# EAGLE schematic ME461_F28379D (EAGLE 7.7.0)

## Sheet 1 of 5
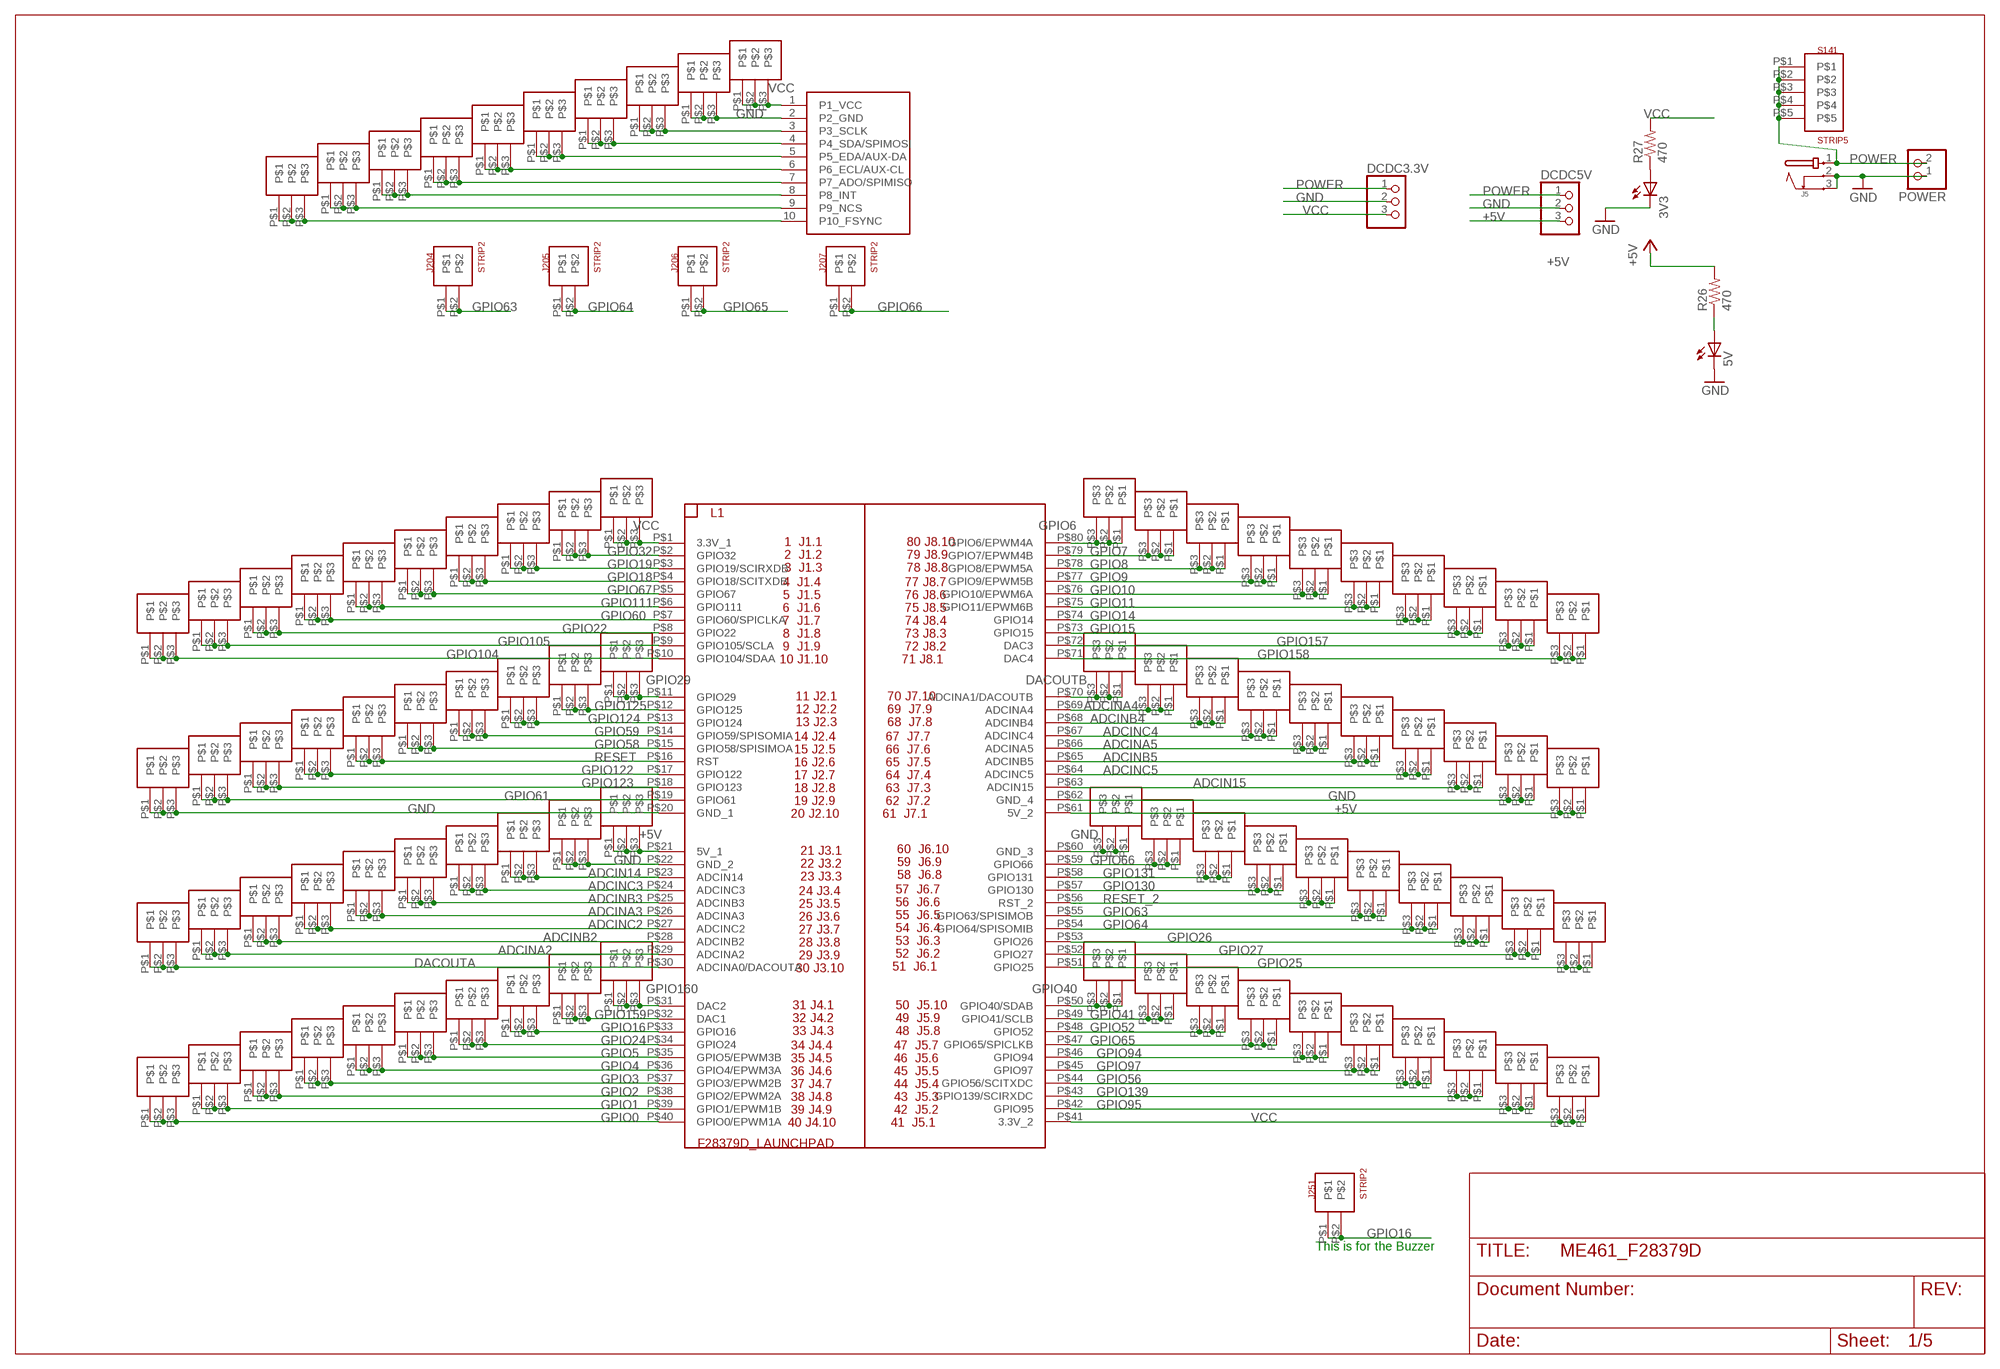
[diagram p0: schematic, sheet 1]

### Parts
3V3  LEDCHIPLED_1206  [CHIPLED_1206]
5V  LEDCHIPLED_1206  [CHIPLED_1206]
DCDC3.3V  PINHD-1X3  [1X03]
DCDC5V  PINHD-1X3  [1X03]
J5  JACK-PMS  [JACK-PMS]
J10  STRIP3  [STRIP3]
J14  STRIP3  [STRIP3]
J15  STRIP3  [STRIP3]
J16  STRIP3  [STRIP3]
J17  STRIP3  [STRIP3]
J18  STRIP3  [STRIP3]
J19  STRIP3  [STRIP3]
J20  STRIP3  [STRIP3]
J21  STRIP3  [STRIP3]
J28  STRIP3  [STRIP3]
J29  STRIP3  [STRIP3]
J30  STRIP3  [STRIP3]
J31  STRIP3  [STRIP3]
J32  STRIP3  [STRIP3]
J33  STRIP3  [STRIP3]
J98  STRIP3  [STRIP3]
J99  STRIP3  [STRIP3]
J100  STRIP3  [STRIP3]
J101  STRIP3  [STRIP3]
J102  STRIP3  [STRIP3]
J103  STRIP3  [STRIP3]
J104  STRIP3  [STRIP3]
J105  STRIP3  [STRIP3]
J106  STRIP3  [STRIP3]
J107  STRIP3  [STRIP3]
J108  STRIP3  [STRIP3]
J109  STRIP3  [STRIP3]
J110  STRIP3  [STRIP3]
J111  STRIP3  [STRIP3]
J112  STRIP3  [STRIP3]
J113  STRIP3  [STRIP3]
J114  STRIP3  [STRIP3]
J115  STRIP3  [STRIP3]
J116  STRIP3  [STRIP3]
J117  STRIP3  [STRIP3]
J118  STRIP3  [STRIP3]
J119  STRIP3  [STRIP3]
J120  STRIP3  [STRIP3]
J121  STRIP3  [STRIP3]
J122  STRIP3  [STRIP3]
J123  STRIP3  [STRIP3]
J124  STRIP3  [STRIP3]
J125  STRIP3  [STRIP3]
J126  STRIP3  [STRIP3]
J127  STRIP3  [STRIP3]
J128  STRIP3  [STRIP3]
J129  STRIP3  [STRIP3]
J130  STRIP3  [STRIP3]
J131  STRIP3  [STRIP3]
J132  STRIP3  [STRIP3]
J133  STRIP3  [STRIP3]
J134  STRIP3  [STRIP3]
J135  STRIP3  [STRIP3]
J136  STRIP3  [STRIP3]
J137  STRIP3  [STRIP3]
J138  STRIP3  [STRIP3]
J139  STRIP3  [STRIP3]
J140  STRIP3  [STRIP3]
J141  STRIP3  [STRIP3]
J142  STRIP3  [STRIP3]
J143  STRIP3  [STRIP3]
J144  STRIP3  [STRIP3]
J145  STRIP3  [STRIP3]
J146  STRIP3  [STRIP3]
J147  STRIP3  [STRIP3]
J148  STRIP3  [STRIP3]
J149  STRIP3  [STRIP3]
J150  STRIP3  [STRIP3]
J151  STRIP3  [STRIP3]
J152  STRIP3  [STRIP3]
J153  STRIP3  [STRIP3]
J154  STRIP3  [STRIP3]
J155  STRIP3  [STRIP3]
J156  STRIP3  [STRIP3]
J157  STRIP3  [STRIP3]
J158  STRIP3  [STRIP3]
J159  STRIP3  [STRIP3]
J160  STRIP3  [STRIP3]
J161  STRIP3  [STRIP3]
J162  STRIP3  [STRIP3]
J163  STRIP3  [STRIP3]
J164  STRIP3  [STRIP3]
J165  STRIP3  [STRIP3]
J166  STRIP3  [STRIP3]
J167  STRIP3  [STRIP3]
J168  STRIP3  [STRIP3]
J169  STRIP3  [STRIP3]
J170  STRIP3  [STRIP3]
J176  STRIP3  [STRIP3]
J177  STRIP3  [STRIP3]
J204  STRIP2  [STRIP2]
J205  STRIP2  [STRIP2]
J206  STRIP2  [STRIP2]
J207  STRIP2  [STRIP2]
J251  STRIP2  [STRIP2]
L1  F28379D_LAUNCHPAD  [F28379D_LAUNCHPAD]
POWER  PINHD-1X2  [1X02]
R26  470  R-US_M1206  [M1206]
R27  470  R-US_M1206  [M1206]
S141  STRIP5  [STRIP5]
U$1  MPU-9250-BB  [MPU-9250-BB]

### Nets
+5V [supply]: DCDC5V.3 J103.P$1 J103.P$2 J103.P$3 J152.P$1 J152.P$2 J152.P$3 L1.P$21(5V_1) L1.P$61(5V_2) R26.2 ; also sheet 2,3,5
ADCIN14: J105.P$1 J105.P$2 J105.P$3 L1.P$23(ADCIN14)
ADCIN15: J150.P$1 J150.P$2 J150.P$3 L1.P$63(ADCIN15)
ADCINA2: J111.P$1 J111.P$2 J111.P$3 L1.P$29(ADCINA2) ; also sheet 5
ADCINA3: J108.P$1 J108.P$2 J108.P$3 L1.P$26(ADCINA3) ; also sheet 5
ADCINA4: J144.P$1 J144.P$2 J144.P$3 L1.P$69(ADCINA4)
ADCINA5: J147.P$1 J147.P$2 J147.P$3 L1.P$66(ADCINA5)
ADCINB2: J110.P$1 J110.P$2 J110.P$3 L1.P$28(ADCINB2)
ADCINB3: J107.P$1 J107.P$2 J107.P$3 L1.P$25(ADCINB3)
ADCINB4: J145.P$1 J145.P$2 J145.P$3 L1.P$68(ADCINB4) ; also sheet 5
ADCINB5: J148.P$1 J148.P$2 J148.P$3 L1.P$65(ADCINB5)
ADCINC2: J109.P$1 J109.P$2 J109.P$3 L1.P$27(ADCINC2)
ADCINC3: J106.P$1 J106.P$2 J106.P$3 L1.P$24(ADCINC3)
ADCINC4: J146.P$1 J146.P$2 J146.P$3 L1.P$67(ADCINC4)
ADCINC5: J149.P$1 J149.P$2 J149.P$3 L1.P$64(ADCINC5)
DACOUTA: J112.P$1 J112.P$2 J112.P$3 L1.P$30(ADCINA0/DACOUTA)
DACOUTB: J143.P$1 J143.P$2 J143.P$3 L1.P$70(ADCINA1/DACOUTB)
GND [supply]: 3V3.C 5V.C DCDC3.3V.2 DCDC5V.2 J5.2 J5.3 J102.P$1 J102.P$2 J102.P$3 J104.P$1 J104.P$2 J104.P$3 J124.P$1 J124.P$2 J124.P$3 J151.P$1 J151.P$2 J151.P$3 J153.P$1 J153.P$2 J153.P$3 L1.P$20(GND_1) L1.P$22(GND_2) L1.P$60(GND_3) L1.P$62(GND_4) POWER.1 U$1.2(P2_GND) ; also sheet 2,3,4,5
GPIO0: J122.P$1 J122.P$2 J122.P$3 L1.P$40(GPIO0/EPWM1A) ; also sheet 5
GPIO1: J121.P$1 J121.P$2 J121.P$3 L1.P$39(GPIO1/EPWM1B) ; also sheet 5
GPIO2: J120.P$1 J120.P$2 J120.P$3 L1.P$38(GPIO2/EPWM2A) ; also sheet 3
GPIO3: J119.P$1 J119.P$2 J119.P$3 L1.P$37(GPIO3/EPWM2B) ; also sheet 3
GPIO4: J118.P$1 J118.P$2 J118.P$3 L1.P$36(GPIO4/EPWM3A) ; also sheet 5
GPIO5: J117.P$1 J117.P$2 J117.P$3 L1.P$35(GPIO5/EPWM3B) ; also sheet 5
GPIO6: J133.P$1 J133.P$2 J133.P$3 L1.P$80(GPIO6/EPWM4A) ; also sheet 5
GPIO7: J134.P$1 J134.P$2 J134.P$3 L1.P$79(GPIO7/EPWM4B) ; also sheet 5
GPIO8: J135.P$1 J135.P$2 J135.P$3 L1.P$78(GPIO8/EPWM5A) ; also sheet 5
GPIO9: J136.P$1 J136.P$2 J136.P$3 L1.P$77(GPIO9/EPWM5B) ; also sheet 2
GPIO10: J137.P$1 J137.P$2 J137.P$3 L1.P$76(GPIO10/EPWM6A) ; also sheet 3
GPIO11: J138.P$1 J138.P$2 J138.P$3 L1.P$75(GPIO11/EPWM6B) ; also sheet 3
GPIO14: J139.P$1 J139.P$2 J139.P$3 L1.P$74(GPIO14) ; also sheet 3
GPIO15: J140.P$1 J140.P$2 J140.P$3 L1.P$73(GPIO15) ; also sheet 3
GPIO16: J115.P$1 J115.P$2 J115.P$3 J251.P$1 J251.P$2 L1.P$33(GPIO16)
GPIO18: J16.P$1 J16.P$2 J16.P$3 L1.P$4(GPIO18/SCITXDB) ; also sheet 5
GPIO19: J15.P$1 J15.P$2 J15.P$3 L1.P$3(GPIO19/SCIRXDB) ; also sheet 5
GPIO22: J20.P$1 J20.P$2 J20.P$3 L1.P$8(GPIO22) ; also sheet 4
GPIO24: J116.P$1 J116.P$2 J116.P$3 L1.P$34(GPIO24) ; also sheet 5
GPIO25: J162.P$1 J162.P$2 J162.P$3 L1.P$51(GPIO25) ; also sheet 4
GPIO26: J160.P$1 J160.P$2 J160.P$3 L1.P$53(GPIO26) ; also sheet 4
GPIO27: J161.P$1 J161.P$2 J161.P$3 L1.P$52(GPIO27) ; also sheet 4
GPIO29: J29.P$1 J29.P$2 J29.P$3 L1.P$11(GPIO29) ; also sheet 3
GPIO32: J14.P$1 J14.P$2 J14.P$3 L1.P$2(GPIO32) ; also sheet 3
GPIO40: J163.P$1 J163.P$2 J163.P$3 L1.P$50(GPIO40/SDAB) ; also sheet 4
GPIO41: J164.P$1 J164.P$2 J164.P$3 L1.P$49(GPIO41/SCLB) ; also sheet 4
GPIO52: J165.P$1 J165.P$2 J165.P$3 L1.P$48(GPIO52)
GPIO56: J169.P$1 J169.P$2 J169.P$3 L1.P$44(GPIO56/SCITXDC) ; also sheet 5
GPIO58: J33.P$1 J33.P$2 J33.P$3 L1.P$15(GPIO58/SPISIMOA) ; also sheet 5
GPIO59: J32.P$1 J32.P$2 J32.P$3 L1.P$14(GPIO59/SPISOMIA) ; also sheet 5
GPIO60: J19.P$1 J19.P$2 J19.P$3 L1.P$7(GPIO60/SPICLKA) ; also sheet 4
GPIO61: J101.P$1 J101.P$2 J101.P$3 L1.P$19(GPIO61) ; also sheet 4
GPIO63: J158.P$1 J158.P$2 J158.P$3 J204.P$1 J204.P$2 L1.P$55(GPIO63/SPISIMOB) ; also sheet 2
GPIO64: J159.P$1 J159.P$2 J159.P$3 J205.P$1 J205.P$2 L1.P$54(GPIO64/SPISOMIB) ; also sheet 2
GPIO65: J166.P$1 J166.P$2 J166.P$3 J206.P$1 J206.P$2 L1.P$47(GPIO65/SPICLKB) ; also sheet 2
GPIO66: J154.P$1 J154.P$2 J154.P$3 J207.P$1 J207.P$2 L1.P$59(GPIO66)
GPIO67: J17.P$1 J17.P$2 J17.P$3 L1.P$5(GPIO67)
GPIO94: J167.P$1 J167.P$2 J167.P$3 L1.P$46(GPIO94) ; also sheet 4
GPIO95: J176.P$1 J176.P$2 J176.P$3 L1.P$42(GPIO95) ; also sheet 4
GPIO97: J168.P$1 J168.P$2 J168.P$3 L1.P$45(GPIO97) ; also sheet 4
GPIO104: J28.P$1 J28.P$2 J28.P$3 L1.P$10(GPIO104/SDAA)
GPIO105: J21.P$1 J21.P$2 J21.P$3 L1.P$9(GPIO105/SCLA)
GPIO111: J18.P$1 J18.P$2 J18.P$3 L1.P$6(GPIO111) ; also sheet 4
GPIO122: J99.P$1 J99.P$2 J99.P$3 L1.P$17(GPIO122) ; also sheet 5
GPIO123: J100.P$1 J100.P$2 J100.P$3 L1.P$18(GPIO123) ; also sheet 5
GPIO124: J31.P$1 J31.P$2 J31.P$3 L1.P$13(GPIO124) ; also sheet 5
GPIO125: J30.P$1 J30.P$2 J30.P$3 L1.P$12(GPIO125) ; also sheet 5
GPIO130: J156.P$1 J156.P$2 J156.P$3 L1.P$57(GPIO130) ; also sheet 4
GPIO131: J155.P$1 J155.P$2 J155.P$3 L1.P$58(GPIO131) ; also sheet 4
GPIO139: J170.P$1 J170.P$2 J170.P$3 L1.P$43(GPIO139/SCIRXDC) ; also sheet 5
GPIO157: J141.P$1 J141.P$2 J141.P$3 L1.P$72(DAC3) ; also sheet 4
GPIO158: J142.P$1 J142.P$2 J142.P$3 L1.P$71(DAC4) ; also sheet 4
GPIO159: J114.P$1 J114.P$2 J114.P$3 L1.P$32(DAC1) ; also sheet 4
GPIO160: J113.P$1 J113.P$2 J113.P$3 L1.P$31(DAC2) ; also sheet 4
N$2: 3V3.A R27.1
N$114: 5V.A R26.1
N$335 [supply]: J125.P$1 J125.P$2 J125.P$3 U$1.3(P3_SCLK)
N$336 [supply]: J126.P$1 J126.P$2 J126.P$3 U$1.4(P4_SDA/SPIMOSI)
N$337 [supply]: J127.P$1 J127.P$2 J127.P$3 U$1.5(P5_EDA/AUX-DA)
N$338 [supply]: J128.P$1 J128.P$2 J128.P$3 U$1.6(P6_ECL/AUX-CL)
N$339 [supply]: J129.P$1 J129.P$2 J129.P$3 U$1.7(P7_ADO/SPIMISO)
N$340 [supply]: J130.P$1 J130.P$2 J130.P$3 U$1.8(P8_INT)
N$341 [supply]: J131.P$1 J131.P$2 J131.P$3 U$1.9(P9_NCS)
N$342 [supply]: J132.P$1 J132.P$2 J132.P$3 U$1.10(P10_FSYNC)
POWER [supply]: DCDC3.3V.1 DCDC5V.1 J5.1 POWER.2 S141.P$1 S141.P$2 S141.P$3 S141.P$4 S141.P$5 ; also sheet 3,5
RESET: J98.P$1 J98.P$2 J98.P$3 L1.P$16(RST)
RESET_2: J157.P$1 J157.P$2 J157.P$3 L1.P$56(RST_2)
VCC [supply]: DCDC3.3V.3 J10.P$1 J10.P$2 J10.P$3 J123.P$1 J123.P$2 J123.P$3 J177.P$1 J177.P$2 J177.P$3 L1.P$1(3.3V_1) L1.P$41(3.3V_2) R27.2 U$1.1(P1_VCC) ; also sheet 2,3,4,5

### Notes on the sheet
- This is for the Buzzer

## Sheet 2 of 5
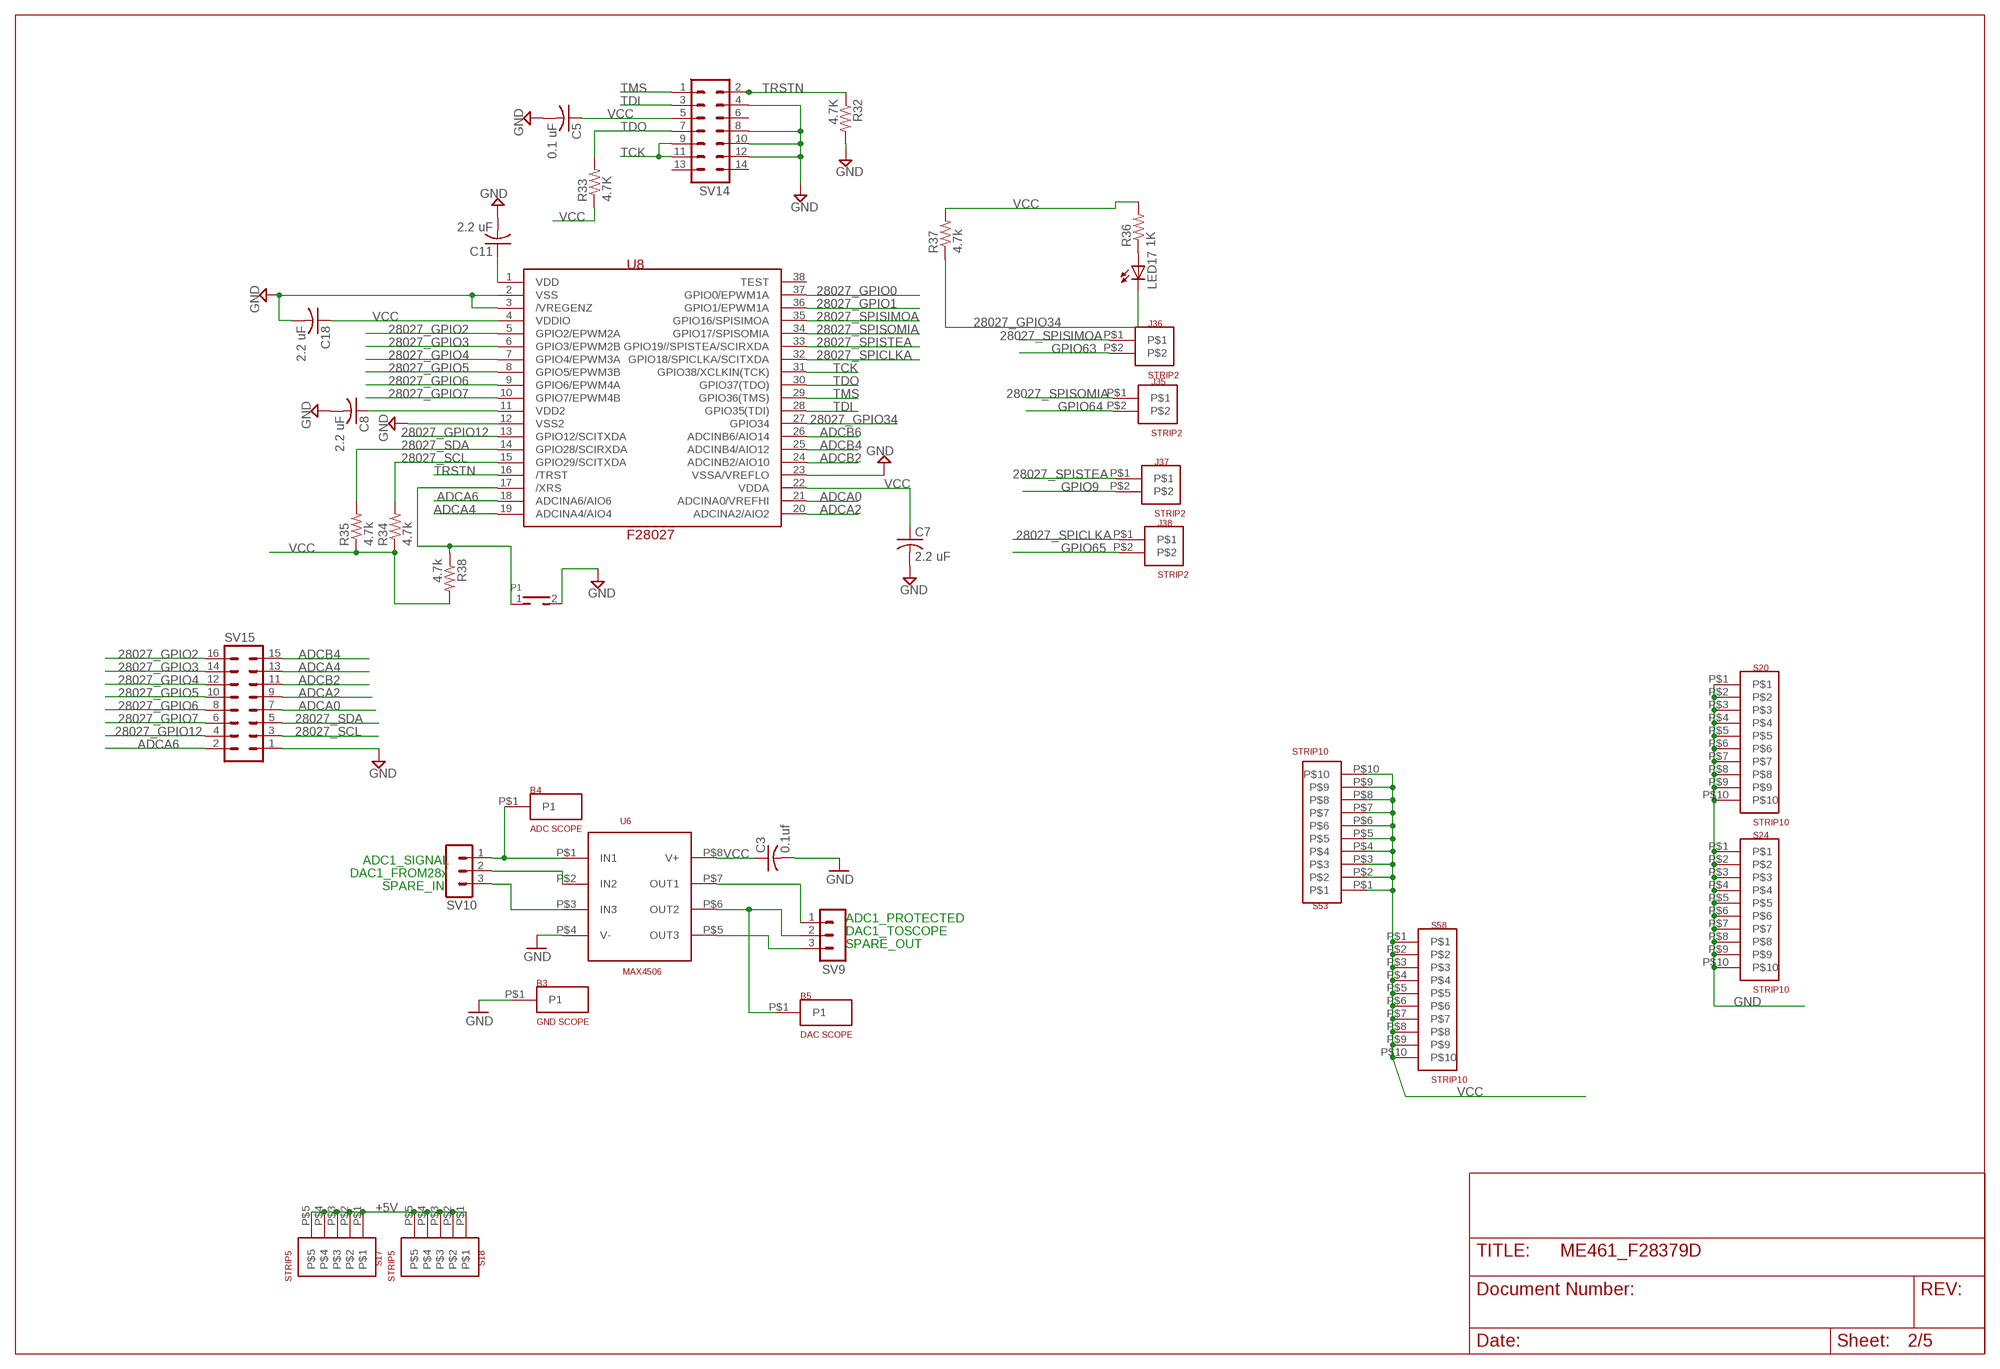
[diagram p1: schematic, sheet 2]

### Parts
B3  GND SCOPE  BANANA_MALE  [BANANA_MALE]
B4  ADC SCOPE  BANANA_MALE  [BANANA_MALE]
B5  DAC SCOPE  BANANA_MALE  [BANANA_MALE]
C3  0.1uf  C-USC1206  [C1206]
C5  0.1 uF  C-USC1206  [C1206]
C7  2.2 uF  C-USC1206  [C1206]
C8  2.2 uF  C-USC1206  [C1206]
C11  2.2 uF  C-USC1206  [C1206]
C18  2.2 uF  C-USC1206  [C1206]
J35  STRIP2  [STRIP2]
J36  STRIP2  [STRIP2]
J37  STRIP2  [STRIP2]
J38  STRIP2  [STRIP2]
LED17  LEDCHIPLED_1206  [CHIPLED_1206]
P1  TH_PUSHBOTTON  [TH_PUSHBUTTON]
R32  4.7K  R-US_M1206  [M1206]
R33  4.7K  R-US_M1206  [M1206]
R34  4.7k  R-US_M1206  [M1206]
R35  4.7k  R-US_M1206  [M1206]
R36  1K  R-US_M1206  [M1206]
R37  4.7k  R-US_M1206  [M1206]
R38  4.7k  R-US_M1206  [M1206]
S17  STRIP5  [STRIP5]
S18  STRIP5  [STRIP5]
S20  STRIP10  [STRIP10]
S24  STRIP10  [STRIP10]
S53  STRIP10  [STRIP10]
S58  STRIP10  [STRIP10]
SV9  MA03-1  [MA03-1]
SV10  MA03-1  [MA03-1]
SV14  MA07-2  [MA07-2]
SV15  MA08-2  [MA08-2]
U6  MAX4506  MAX4506-SOIC8  [SOIC-8]
U8  F28027  TMS320F28027DAS  [DA38]

### Nets
28027_GPIO0: U8.37(GPIO0/EPWM1A) ; also sheet 3
28027_GPIO1: U8.36(GPIO1/EPWM1A) ; also sheet 3
28027_GPIO2: SV15.16 U8.5(GPIO2/EPWM2A)
28027_GPIO3: SV15.14 U8.6(GPIO3/EPWM2B)
28027_GPIO4: SV15.12 U8.7(GPIO4/EPWM3A)
28027_GPIO5: SV15.10 U8.8(GPIO5/EPWM3B)
28027_GPIO6: SV15.8 U8.9(GPIO6/EPWM4A)
28027_GPIO7: SV15.6 U8.10(GPIO7/EPWM4B)
28027_GPIO12: SV15.4 U8.13(GPIO12/SCITXDA)
28027_GPIO34: LED17.C R37.1 U8.27(GPIO34)
28027_SCL: R34.2 SV15.3 U8.15(GPIO29/SCITXDA)
28027_SDA: R35.2 SV15.5 U8.14(GPIO28/SCIRXDA)
28027_SPICLKA: J38.P$1 U8.32(GPIO18/SPICLKA/SCITXDA)
28027_SPISIMOA: J36.P$1 U8.35(GPIO16/SPISIMOA)
28027_SPISOMIA: J35.P$1 U8.34(GPIO17/SPISOMIA)
28027_SPISTEA: J37.P$1 U8.33(GPIO19//SPISTEA/SCIRXDA)
+5V [supply]: S17.P$1 S17.P$2 S17.P$3 S17.P$4 S17.P$5 S18.P$1 S18.P$2 S18.P$3 S18.P$4 S18.P$5 ; also sheet 1,3,5
ADCA0: SV15.7 U8.21(ADCINA0/VREFHI)
ADCA2: SV15.9 U8.20(ADCINA2/AIO2)
ADCA4: SV15.13 U8.19(ADCINA4/AIO4)
ADCA6: SV15.2 U8.18(ADCINA6/AIO6)
ADCB2: SV15.11 U8.24(ADCINB2/AIO10)
ADCB4: SV15.15 U8.25(ADCINB4/AIO12)
ADCB6: U8.26(ADCINB6/AIO14)
GND [supply]: B3.P$1(P1) C3.2 C5.2 C7.2 C8.2 C11.2 C18.2 P1.2 R32.2 S20.P$1 S20.P$2 S20.P$3 S20.P$4 S20.P$5 S20.P$6 S20.P$7 S20.P$8 S20.P$9 S20.P$10 S24.P$1 S24.P$2 S24.P$3 S24.P$4 S24.P$5 S24.P$6 S24.P$7 S24.P$8 S24.P$9 S24.P$10 SV14.4 SV14.8 SV14.10 SV14.12 SV15.1 U6.P$4(V-) U8.2(VSS) U8.3(/VREGENZ) U8.12(VSS2) U8.23(VSSA/VREFLO) ; also sheet 1,3,4,5
GPIO9: J37.P$2 ; also sheet 1
GPIO63: J36.P$2 ; also sheet 1
GPIO64: J35.P$2 ; also sheet 1
GPIO65: J38.P$2 ; also sheet 1
N$3: SV9.1 U6.P$7(OUT1)
N$4: B5.P$1(P1) SV9.2 U6.P$6(OUT2)
N$5: SV9.3 U6.P$5(OUT3)
N$6: B4.P$1(P1) SV10.1 U6.P$1(IN1)
N$7: SV10.2 U6.P$2(IN2)
N$8: SV10.3 U6.P$3(IN3)
N$14: C11.1 U8.1(VDD)
N$15: C8.1 U8.11(VDD2)
N$16: P1.1 R38.1 U8.17(/XRS)
N$18: LED17.A R36.1
TCK: SV14.9 SV14.11 U8.31(GPIO38/XCLKIN(TCK))
TDI: SV14.3 U8.28(GPIO35(TDI))
TDO: R33.2 SV14.7 U8.30(GPIO37(TDO))
TMS: SV14.1 U8.29(GPIO36(TMS))
TRSTN: R32.1 SV14.2 U8.16(/TRST)
VCC [supply]: C3.1 C5.1 C7.1 C18.1 R33.1 R34.1 R35.1 R36.2 R37.2 R38.2 S53.P$1 S53.P$2 S53.P$3 S53.P$4 S53.P$5 S53.P$6 S53.P$7 S53.P$8 S53.P$9 S53.P$10 S58.P$1 S58.P$2 S58.P$3 S58.P$4 S58.P$5 S58.P$6 S58.P$7 S58.P$8 S58.P$9 S58.P$10 SV14.5 U6.P$8(V+) U8.4(VDDIO) U8.22(VDDA) ; also sheet 1,3,4,5
Unconnected: SV14.6 SV14.13 SV14.14 U8.38(TEST)

### Notes on the sheet
- ADC1_SIGNAL
- DAC1_FROM28x
- SPARE_IN
- ADC1_PROTECTED
- DAC1_TOSCOPE
- SPARE_OUT

## Sheet 3 of 5
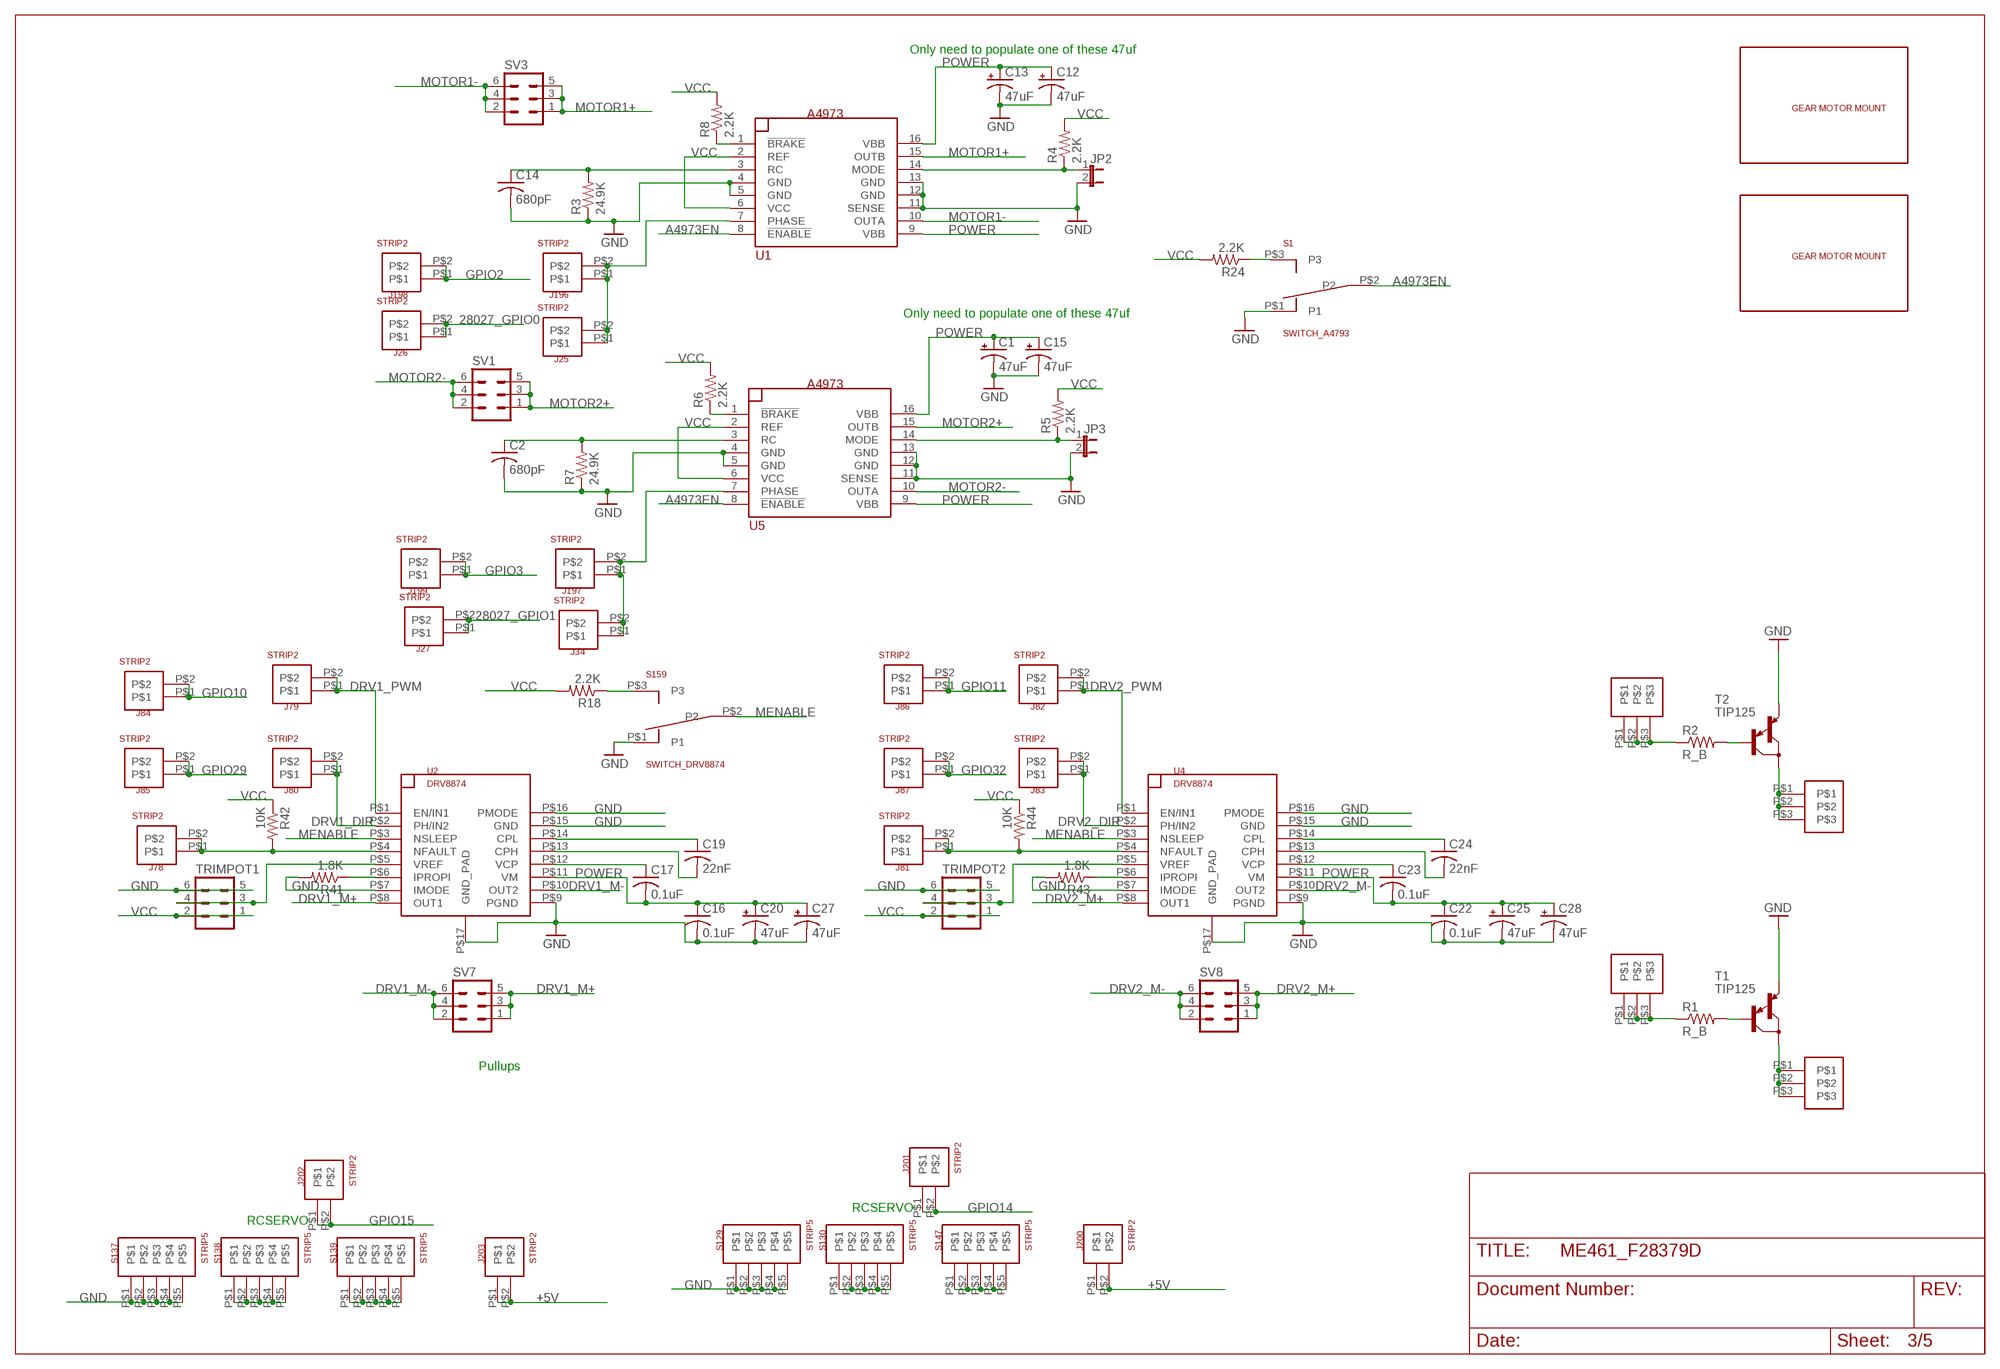
[diagram p2: schematic, sheet 3]

### Parts
C1  47uF  CPOL-US153CLV-0810  [153CLV-0810]
C2  680pF  C-USC1206  [C1206]
C12  47uF  CPOL-US153CLV-0810  [153CLV-0810]
C13  47uF  CPOL-US153CLV-0810  [153CLV-0810]
C14  680pF  C-USC1206  [C1206]
C15  47uF  CPOL-US153CLV-0810  [153CLV-0810]
C16  0.1uF  C-USC1206  [C1206]
C17  0.1uF  C-USC1206  [C1206]
C19  22nF  C-USC1206  [C1206]
C20  47uF  CPOL-US153CLV-0810  [153CLV-0810]
C22  0.1uF  C-USC1206  [C1206]
C23  0.1uF  C-USC1206  [C1206]
C24  22nF  C-USC1206  [C1206]
C25  47uF  CPOL-US153CLV-0810  [153CLV-0810]
C27  47uF  CPOL-US153CLV-0810  [153CLV-0810]
C28  47uF  CPOL-US153CLV-0810  [153CLV-0810]
J4  STRIP3  [STRIP3]
J6  STRIP3  [STRIP3]
J23  STRIP3  [STRIP3]
J24  STRIP3  [STRIP3]
J25  STRIP2  [STRIP2]
J26  STRIP2  [STRIP2]
J27  STRIP2  [STRIP2]
J34  STRIP2  [STRIP2]
J78  STRIP2  [STRIP2]
J79  STRIP2  [STRIP2]
J80  STRIP2  [STRIP2]
J81  STRIP2  [STRIP2]
J82  STRIP2  [STRIP2]
J83  STRIP2  [STRIP2]
J84  STRIP2  [STRIP2]
J85  STRIP2  [STRIP2]
J86  STRIP2  [STRIP2]
J87  STRIP2  [STRIP2]
J196  STRIP2  [STRIP2]
J197  STRIP2  [STRIP2]
J198  STRIP2  [STRIP2]
J199  STRIP2  [STRIP2]
J200  STRIP2  [STRIP2]
J201  STRIP2  [STRIP2]
J202  STRIP2  [STRIP2]
J203  STRIP2  [STRIP2]
JP2  JP1E  [JP1]
JP3  JP1E  [JP1]
R1  R_B  R-US_0207/10  [0207/10]
R2  R_B  R-US_0207/10  [0207/10]
R3  24.9K  R-US_M1206  [M1206]
R4  2.2K  R-US_M1206  [M1206]
R5  2.2K  R-US_M1206  [M1206]
R6  2.2K  R-US_M1206  [M1206]
R7  24.9K  R-US_M1206  [M1206]
R8  2.2K  R-US_M1206  [M1206]
R18  2.2K  R-US_M1206  [M1206]
R24  2.2K  R-US_M1206  [M1206]
R41  1.8K  R-US_M1206  [M1206]
R42  10K  R-US_M1206  [M1206]
R43  1.8K  R-US_M1206  [M1206]
R44  10K  R-US_M1206  [M1206]
S1  SWITCH_A4793  SWITCH_SLIDE  [SWITCH_SLIDE]
S129  STRIP5  [STRIP5]
S130  STRIP5  [STRIP5]
S137  STRIP5  [STRIP5]
S138  STRIP5  [STRIP5]
S139  STRIP5  [STRIP5]
S147  STRIP5  [STRIP5]
S159  SWITCH_DRV8874  SWITCH_SLIDE  [SWITCH_SLIDE]
SV1  MA03-2  [MA03-2]
SV3  MA03-2  [MA03-2]
SV7  MA03-2  [MA03-2]
SV8  MA03-2  [MA03-2]
T1  TIP125  [TO220]
T2  TIP125  [TO220]
TRIMPOT1  MA03-2  [MA03-2]
TRIMPOT2  MA03-2  [MA03-2]
U1  A4973  A3953  [SO16W]
U2  DRV8874  [HTSSOP16]
U4  DRV8874  [HTSSOP16]
U5  A4973  A3953  [SO16W]
U$2  GEARMOTOR_MOUNT  [GEARMOTOR_MOUNT]
U$3  GEARMOTOR_MOUNT  [GEARMOTOR_MOUNT]

### Nets
28027_GPIO0: J26.P$1 J26.P$2 ; also sheet 2
28027_GPIO1: J27.P$1 J27.P$2 ; also sheet 2
+5V [supply]: J200.P$1 J200.P$2 J203.P$1 J203.P$2 ; also sheet 1,2,5
A4973EN: S1.P$2(P2) U1.8(!ENABLE) U5.8(!ENABLE)
DRV1_DIR: J80.P$1 J80.P$2 U2.P$2(PH/IN2)
DRV1_M+: SV7.1 SV7.3 SV7.5 U2.P$8(OUT1)
DRV1_M-: SV7.2 SV7.4 SV7.6 U2.P$10(OUT2)
DRV1_PWM: J79.P$1 J79.P$2 U2.P$1(EN/IN1)
DRV2_DIR: J83.P$1 J83.P$2 U4.P$2(PH/IN2)
DRV2_M+: SV8.1 SV8.3 SV8.5 U4.P$8(OUT1)
DRV2_M-: SV8.2 SV8.4 SV8.6 U4.P$10(OUT2)
DRV2_PWM: J82.P$1 J82.P$2 U4.P$1(EN/IN1)
GND [supply]: C1.- C2.2 C12.- C13.- C14.2 C15.- C16.2 C20.- C22.2 C25.- C27.- C28.- JP2.2 JP3.2 R3.1 R7.1 R41.2 R43.2 S1.P$1(P1) S129.P$1 S129.P$2 S129.P$3 S129.P$4 S129.P$5 S137.P$1 S137.P$2 S137.P$3 S137.P$4 S137.P$5 S159.P$1(P1) T1.3(E) T2.3(E) TRIMPOT1.5 TRIMPOT1.6 TRIMPOT2.5 TRIMPOT2.6 U1.4(GND) U1.5(GND) U1.11(SENSE) U1.12(GND) U1.13(GND) U2.P$7(IMODE) U2.P$9(PGND) U2.P$15(GND) U2.P$16(PMODE) U2.P$17(GND_PAD) U4.P$7(IMODE) U4.P$9(PGND) U4.P$15(GND) U4.P$16(PMODE) U4.P$17(GND_PAD) U5.4(GND) U5.5(GND) U5.11(SENSE) U5.12(GND) U5.13(GND) ; also sheet 1,2,4,5
GPIO2: J198.P$1 J198.P$2 ; also sheet 1
GPIO3: J199.P$1 J199.P$2 ; also sheet 1
GPIO10: J84.P$1 J84.P$2 ; also sheet 1
GPIO11: J86.P$1 J86.P$2 ; also sheet 1
GPIO14: J201.P$1 J201.P$2 ; also sheet 1
GPIO15: J202.P$1 J202.P$2 ; also sheet 1
GPIO29: J85.P$1 J85.P$2 ; also sheet 1
GPIO32: J87.P$1 J87.P$2 ; also sheet 1
MENABLE: S159.P$2(P2) U2.P$3(NSLEEP) U4.P$3(NSLEEP)
MOTOR1+ [supply]: SV3.1 SV3.3 SV3.5 U1.15(OUTB)
MOTOR1- [supply]: SV3.2 SV3.4 SV3.6 U1.10(OUTA)
MOTOR2+ [supply]: SV1.1 SV1.3 SV1.5 U5.15(OUTB)
MOTOR2- [supply]: SV1.2 SV1.4 SV1.6 U5.10(OUTA)
N$1: R24.1 S1.P$3(P3)
N$9 [supply]: S139.P$1 S139.P$2 S139.P$3 S139.P$4 S139.P$5
N$10 [supply]: S147.P$1 S147.P$2 S147.P$3 S147.P$4 S147.P$5
N$31: R2.2 T2.1(B)
N$87: R1.2 T1.1(B)
N$88 [supply]: S138.P$1 S138.P$2 S138.P$3 S138.P$4 S138.P$5
N$125: R6.1 U5.1(!BRAKE)
N$127: C2.1 R7.2 U5.3(RC)
N$129: R8.1 U1.1(!BRAKE)
N$130: C14.1 R3.2 U1.3(RC)
N$131: JP2.1 R4.1 U1.14(MODE)
N$132: R18.1 S159.P$3(P3)
N$133: JP3.1 R5.1 U5.14(MODE)
N$175: C19.1 U2.P$14(CPL)
N$176: C19.2 U2.P$13(CPH)
N$177: C17.1 U2.P$12(VCP)
N$178: R43.1 U4.P$6(IPROPI)
N$179: R41.1 U2.P$6(IPROPI)
N$186: J78.P$1 J78.P$2 R42.2 U2.P$4(NFAULT)
N$187: TRIMPOT1.3 TRIMPOT1.4 U2.P$5(VREF)
N$188: C24.1 U4.P$14(CPL)
N$189: C24.2 U4.P$13(CPH)
N$190: C23.1 U4.P$12(VCP)
N$191: J81.P$1 J81.P$2 R44.2 U4.P$4(NFAULT)
N$192: TRIMPOT2.3 TRIMPOT2.4 U4.P$5(VREF)
N$407 [supply]: S130.P$1 S130.P$2 S130.P$3 S130.P$4 S130.P$5
N$414: J25.P$1 J25.P$2 J196.P$1 J196.P$2 U1.7(PHASE)
N$425: J34.P$1 J34.P$2 J197.P$1 J197.P$2 U5.7(PHASE)
POWER [supply]: C1.+ C12.+ C13.+ C15.+ C16.1 C17.2 C20.+ C22.1 C23.2 C25.+ C27.+ C28.+ U1.9(VBB) U1.16(VBB) U2.P$11(VM) U4.P$11(VM) U5.9(VBB) U5.16(VBB) ; also sheet 1,5
TR_BASE: J6.P$1 J6.P$2 J6.P$3 R1.1
TR_BASE1: J24.P$1 J24.P$2 J24.P$3 R2.1
TR_LOAD: J4.P$1 J4.P$2 J4.P$3 T1.2(C)
TR_LOAD1: J23.P$1 J23.P$2 J23.P$3 T2.2(C)
VCC [supply]: R4.2 R5.2 R6.2 R8.2 R18.2 R24.2 R42.1 R44.1 TRIMPOT1.1 TRIMPOT1.2 TRIMPOT2.1 TRIMPOT2.2 U1.2(REF) U1.6(VCC) U5.2(REF) U5.6(VCC) ; also sheet 1,2,4,5

### Notes on the sheet
- Only need to populate one of these 47uf
- Only need to populate one of these 47uf
- Pullups
- RCSERVO
- RCSERVO

## Sheet 4 of 5
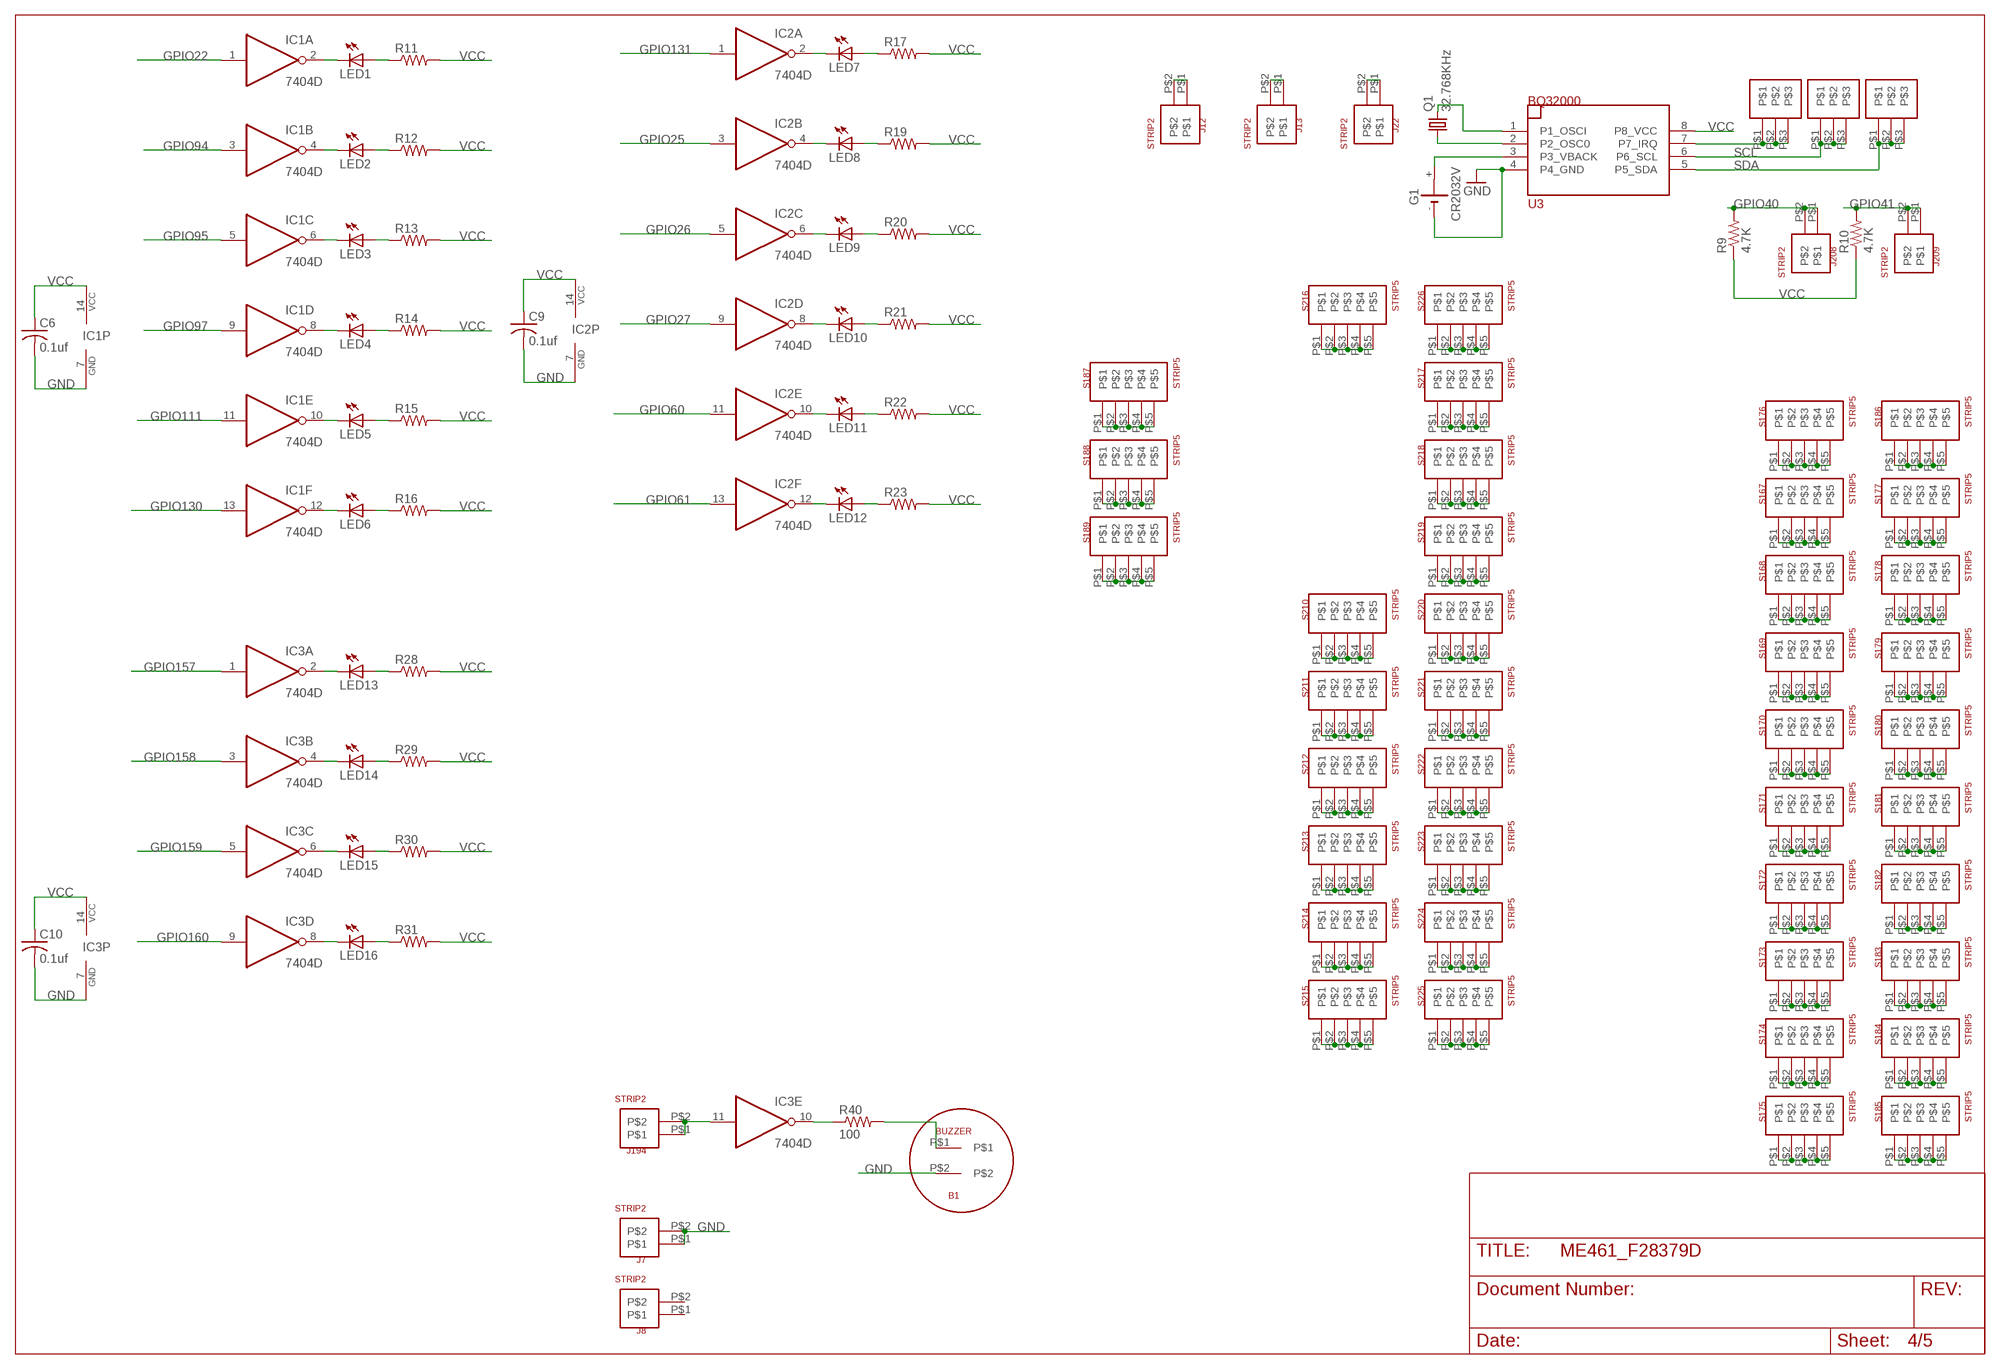
[diagram p3: schematic, sheet 4]

### Parts
B1  BUZZER  [BUZZER]
C6  0.1uf  C-USC1206  [C1206]
C9  0.1uf  C-USC1206  [C1206]
C10  0.1uf  C-USC1206  [C1206]
G1  CR2032V  [CR2032V]
IC1  7404D  [SO14]
IC2  7404D  [SO14]
IC3  7404D  [SO14]
J1  STRIP3  [STRIP3]
J2  STRIP3  [STRIP3]
J3  STRIP3  [STRIP3]
J7  STRIP2  [STRIP2]
J8  STRIP2  [STRIP2]
J12  STRIP2  [STRIP2]
J13  STRIP2  [STRIP2]
J22  STRIP2  [STRIP2]
J194  STRIP2  [STRIP2]
J208  STRIP2  [STRIP2]
J209  STRIP2  [STRIP2]
LED1  LEDCHIPLED_1206  [CHIPLED_1206]
LED2  LEDCHIPLED_1206  [CHIPLED_1206]
LED3  LEDCHIPLED_1206  [CHIPLED_1206]
LED4  LEDCHIPLED_1206  [CHIPLED_1206]
LED5  LEDCHIPLED_1206  [CHIPLED_1206]
LED6  LEDCHIPLED_1206  [CHIPLED_1206]
LED7  LEDCHIPLED_1206  [CHIPLED_1206]
LED8  LEDCHIPLED_1206  [CHIPLED_1206]
LED9  LEDCHIPLED_1206  [CHIPLED_1206]
LED10  LEDCHIPLED_1206  [CHIPLED_1206]
LED11  LEDCHIPLED_1206  [CHIPLED_1206]
LED12  LEDCHIPLED_1206  [CHIPLED_1206]
LED13  LEDCHIPLED_1206  [CHIPLED_1206]
LED14  LEDCHIPLED_1206  [CHIPLED_1206]
LED15  LEDCHIPLED_1206  [CHIPLED_1206]
LED16  LEDCHIPLED_1206  [CHIPLED_1206]
Q1  32.768KHz  CRYTALTC26H  [TC26H]
R9  4.7K  R-US_R1206  [R1206]
R10  4.7K  R-US_R1206  [R1206]
R11  R-US_R1206  [R1206]
R12  R-US_R1206  [R1206]
R13  R-US_R1206  [R1206]
R14  R-US_R1206  [R1206]
R15  R-US_R1206  [R1206]
R16  R-US_R1206  [R1206]
R17  R-US_R1206  [R1206]
R19  R-US_R1206  [R1206]
R20  R-US_R1206  [R1206]
R21  R-US_R1206  [R1206]
R22  R-US_R1206  [R1206]
R23  R-US_R1206  [R1206]
R28  R-US_R1206  [R1206]
R29  R-US_R1206  [R1206]
R30  R-US_R1206  [R1206]
R31  R-US_R1206  [R1206]
R40  100  R-US_R1206  [R1206]
S167  STRIP5  [STRIP5]
S168  STRIP5  [STRIP5]
S169  STRIP5  [STRIP5]
S170  STRIP5  [STRIP5]
S171  STRIP5  [STRIP5]
S172  STRIP5  [STRIP5]
S173  STRIP5  [STRIP5]
S174  STRIP5  [STRIP5]
S175  STRIP5  [STRIP5]
S176  STRIP5  [STRIP5]
S177  STRIP5  [STRIP5]
S178  STRIP5  [STRIP5]
S179  STRIP5  [STRIP5]
S180  STRIP5  [STRIP5]
S181  STRIP5  [STRIP5]
S182  STRIP5  [STRIP5]
S183  STRIP5  [STRIP5]
S184  STRIP5  [STRIP5]
S185  STRIP5  [STRIP5]
S186  STRIP5  [STRIP5]
S187  STRIP5  [STRIP5]
S188  STRIP5  [STRIP5]
S189  STRIP5  [STRIP5]
S210  STRIP5  [STRIP5]
S211  STRIP5  [STRIP5]
S212  STRIP5  [STRIP5]
S213  STRIP5  [STRIP5]
S214  STRIP5  [STRIP5]
S215  STRIP5  [STRIP5]
S216  STRIP5  [STRIP5]
S217  STRIP5  [STRIP5]
S218  STRIP5  [STRIP5]
S219  STRIP5  [STRIP5]
S220  STRIP5  [STRIP5]
S221  STRIP5  [STRIP5]
S222  STRIP5  [STRIP5]
S223  STRIP5  [STRIP5]
S224  STRIP5  [STRIP5]
S225  STRIP5  [STRIP5]
S226  STRIP5  [STRIP5]
U3  BQ32000  [SO08]

### Nets
GND [supply]: B1.P$2 C6.2 C9.2 C10.2 G1.- IC1.7(P:GND) IC2.7(P:GND) IC3.7(P:GND) J7.P$1 J7.P$2 U3.4(P4_GND) ; also sheet 1,2,3,5
GPIO22: IC1.1(A:I) ; also sheet 1
GPIO25: IC2.3(B:I) ; also sheet 1
GPIO26: IC2.5(C:I) ; also sheet 1
GPIO27: IC2.9(D:I) ; also sheet 1
GPIO40: J208.P$1 J208.P$2 R9.2 ; also sheet 1
GPIO41: J209.P$1 J209.P$2 R10.2 ; also sheet 1
GPIO60: IC2.11(E:I) ; also sheet 1
GPIO61: IC2.13(F:I) ; also sheet 1
GPIO94: IC1.3(B:I) ; also sheet 1
GPIO95: IC1.5(C:I) ; also sheet 1
GPIO97: IC1.9(D:I) ; also sheet 1
GPIO111: IC1.11(E:I) ; also sheet 1
GPIO130: IC1.13(F:I) ; also sheet 1
GPIO131: IC2.1(A:I) ; also sheet 1
GPIO157: IC3.1(A:I) ; also sheet 1
GPIO158: IC3.3(B:I) ; also sheet 1
GPIO159: IC3.5(C:I) ; also sheet 1
GPIO160: IC3.9(D:I) ; also sheet 1
N$11 [supply]: J12.P$1 J12.P$2
N$12 [supply]: J13.P$1 J13.P$2
N$13 [supply]: J22.P$1 J22.P$2
N$48: IC3.10(E:O) R40.1
N$50: B1.P$1 R40.2
N$51: Q1.1 U3.2(P2_OSC0)
N$70: Q1.2 U3.1(P1_OSCI)
N$118: J1.P$1 J1.P$2 J1.P$3 U3.7(P7_IRQ)
N$119: G1.+ U3.3(P3_VBACK)
N$157: IC2.2(A:O) LED7.C
N$158: LED7.A R17.1
N$160: IC2.4(B:O) LED8.C
N$161: LED8.A R19.1
N$164: IC2.6(C:O) LED9.C
N$268 [supply]: S167.P$1 S167.P$2 S167.P$3 S167.P$4 S167.P$5
N$269 [supply]: S168.P$1 S168.P$2 S168.P$3 S168.P$4 S168.P$5
N$270 [supply]: S169.P$1 S169.P$2 S169.P$3 S169.P$4 S169.P$5
N$271 [supply]: S170.P$1 S170.P$2 S170.P$3 S170.P$4 S170.P$5
N$272 [supply]: S171.P$1 S171.P$2 S171.P$3 S171.P$4 S171.P$5
N$273 [supply]: S172.P$1 S172.P$2 S172.P$3 S172.P$4 S172.P$5
N$274 [supply]: S173.P$1 S173.P$2 S173.P$3 S173.P$4 S173.P$5
N$275 [supply]: S174.P$1 S174.P$2 S174.P$3 S174.P$4 S174.P$5
N$276 [supply]: S175.P$1 S175.P$2 S175.P$3 S175.P$4 S175.P$5
N$277 [supply]: S176.P$1 S176.P$2 S176.P$3 S176.P$4 S176.P$5
N$278 [supply]: S177.P$1 S177.P$2 S177.P$3 S177.P$4 S177.P$5
N$279 [supply]: S178.P$1 S178.P$2 S178.P$3 S178.P$4 S178.P$5
N$280 [supply]: S179.P$1 S179.P$2 S179.P$3 S179.P$4 S179.P$5
N$281 [supply]: S180.P$1 S180.P$2 S180.P$3 S180.P$4 S180.P$5
N$282 [supply]: S181.P$1 S181.P$2 S181.P$3 S181.P$4 S181.P$5
N$283 [supply]: S182.P$1 S182.P$2 S182.P$3 S182.P$4 S182.P$5
N$284 [supply]: S183.P$1 S183.P$2 S183.P$3 S183.P$4 S183.P$5
N$285 [supply]: S184.P$1 S184.P$2 S184.P$3 S184.P$4 S184.P$5
N$286 [supply]: S185.P$1 S185.P$2 S185.P$3 S185.P$4 S185.P$5
N$287 [supply]: S186.P$1 S186.P$2 S186.P$3 S186.P$4 S186.P$5
N$288 [supply]: S187.P$1 S187.P$2 S187.P$3 S187.P$4 S187.P$5
N$289 [supply]: S188.P$1 S188.P$2 S188.P$3 S188.P$4 S188.P$5
N$290 [supply]: S189.P$1 S189.P$2 S189.P$3 S189.P$4 S189.P$5
N$311 [supply]: S210.P$1 S210.P$2 S210.P$3 S210.P$4 S210.P$5
N$312 [supply]: S211.P$1 S211.P$2 S211.P$3 S211.P$4 S211.P$5
N$313 [supply]: S212.P$1 S212.P$2 S212.P$3 S212.P$4 S212.P$5
N$314 [supply]: S213.P$1 S213.P$2 S213.P$3 S213.P$4 S213.P$5
N$315 [supply]: S214.P$1 S214.P$2 S214.P$3 S214.P$4 S214.P$5
N$316 [supply]: S215.P$1 S215.P$2 S215.P$3 S215.P$4 S215.P$5
N$317 [supply]: S216.P$1 S216.P$2 S216.P$3 S216.P$4 S216.P$5
N$318 [supply]: S217.P$1 S217.P$2 S217.P$3 S217.P$4 S217.P$5
N$319 [supply]: S218.P$1 S218.P$2 S218.P$3 S218.P$4 S218.P$5
N$320 [supply]: S219.P$1 S219.P$2 S219.P$3 S219.P$4 S219.P$5
N$321 [supply]: S220.P$1 S220.P$2 S220.P$3 S220.P$4 S220.P$5
N$322 [supply]: S221.P$1 S221.P$2 S221.P$3 S221.P$4 S221.P$5
N$323 [supply]: S222.P$1 S222.P$2 S222.P$3 S222.P$4 S222.P$5
N$324 [supply]: S223.P$1 S223.P$2 S223.P$3 S223.P$4 S223.P$5
N$325 [supply]: S224.P$1 S224.P$2 S224.P$3 S224.P$4 S224.P$5
N$326 [supply]: S225.P$1 S225.P$2 S225.P$3 S225.P$4 S225.P$5
N$327 [supply]: S226.P$1 S226.P$2 S226.P$3 S226.P$4 S226.P$5
N$344: IC1.2(A:O) LED1.C
N$345: LED1.A R11.1
N$347: IC1.4(B:O) LED2.C
N$348: LED2.A R12.1
N$350: IC1.6(C:O) LED3.C
N$351: LED3.A R13.1
N$353: IC1.8(D:O) LED4.C
N$354: LED4.A R14.1
N$356: IC1.10(E:O) LED5.C
N$357: LED5.A R15.1
N$359: IC1.12(F:O) LED6.C
N$360: LED6.A R16.1
N$361: LED9.A R20.1
N$363: IC2.8(D:O) LED10.C
N$364: LED10.A R21.1
N$366: IC2.10(E:O) LED11.C
N$367: LED11.A R22.1
N$369: IC2.12(F:O) LED12.C
N$370: LED12.A R23.1
N$372: IC3.2(A:O) LED13.C
N$373: LED13.A R28.1
N$375: IC3.4(B:O) LED14.C
N$376: LED14.A R29.1
N$378: IC3.6(C:O) LED15.C
N$379: LED15.A R30.1
N$381: IC3.8(D:O) LED16.C
N$382: LED16.A R31.1
N$404: IC3.11(E:I) J194.P$1 J194.P$2
SCL: J2.P$1 J2.P$2 J2.P$3 U3.6(P6_SCL)
SDA: J3.P$1 J3.P$2 J3.P$3 U3.5(P5_SDA)
VCC [supply]: C6.1 C9.1 C10.1 IC1.14(P:VCC) IC2.14(P:VCC) IC3.14(P:VCC) R9.1 R10.1 R11.2 R12.2 R13.2 R14.2 R15.2 R16.2 R17.2 R19.2 R20.2 R21.2 R22.2 R23.2 R28.2 R29.2 R30.2 R31.2 U3.8(P8_VCC) ; also sheet 1,2,3,5
Unconnected: G1.+@1(+) IC3.12(F:O) IC3.13(F:I) J8.P$1 J8.P$2

## Sheet 5 of 5
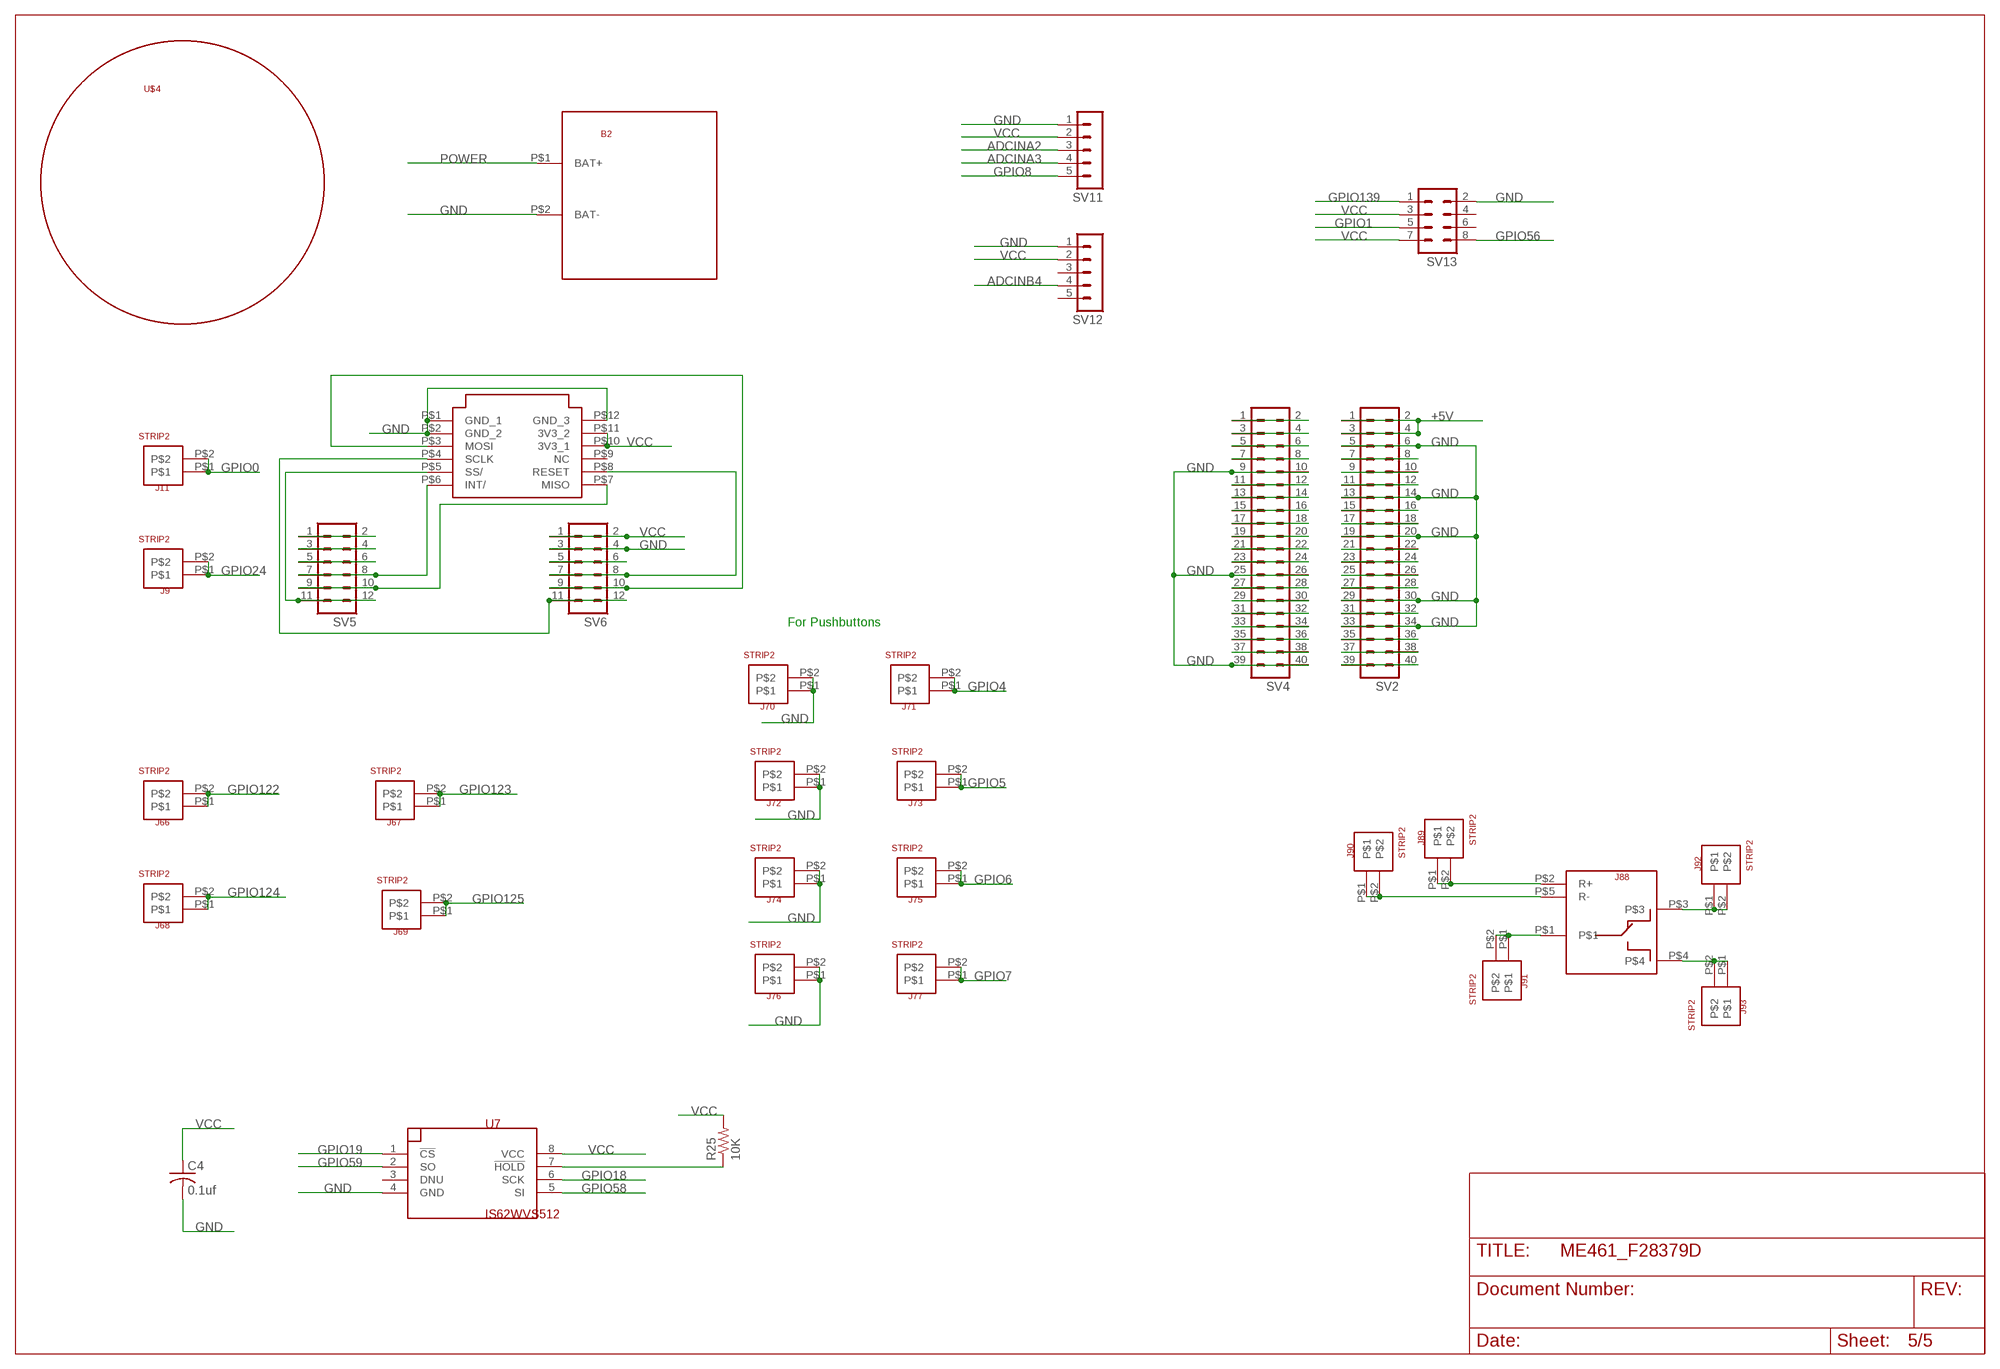
[diagram p4: schematic, sheet 5]

### Parts
B2  BATTERY_4AA_HOLDER  [BATTERY_4AA_HOLDER]
C4  0.1uf  C-USC1206  [C1206]
ETH1  USR_ES1_W5500  [USR_ES1_W5500]
J9  STRIP2  [STRIP2]
J11  STRIP2  [STRIP2]
J66  STRIP2  [STRIP2]
J67  STRIP2  [STRIP2]
J68  STRIP2  [STRIP2]
J69  STRIP2  [STRIP2]
J70  STRIP2  [STRIP2]
J71  STRIP2  [STRIP2]
J72  STRIP2  [STRIP2]
J73  STRIP2  [STRIP2]
J74  STRIP2  [STRIP2]
J75  STRIP2  [STRIP2]
J76  STRIP2  [STRIP2]
J77  STRIP2  [STRIP2]
J88  RELAY_JQC-3F_5V  [RELAY_JQC-3F_5V]
J89  STRIP2  [STRIP2]
J90  STRIP2  [STRIP2]
J91  STRIP2  [STRIP2]
J92  STRIP2  [STRIP2]
J93  STRIP2  [STRIP2]
R25  10K  R-US_M1206  [M1206]
SV2  MA20-2  [MA20-2]
SV4  MA20-2  [MA20-2]
SV5  MA06-2  [MA06-2]
SV6  MA06-2  [MA06-2]
SV11  MA05-1  [MA05-1]
SV12  MA05-1  [MA05-1]
SV13  MA04-2  [MA04-2]
U7  IS62WVS512  [SO08]
U$4  CASTERWHEEL  [CASTERWHEEL]

### Nets
+5V [supply]: SV2.1 SV2.2 SV2.3 SV2.4 ; also sheet 1,2,3
ADCINA2: SV11.3 ; also sheet 1
ADCINA3: SV11.4 ; also sheet 1
ADCINB4: SV12.4 ; also sheet 1
GND [supply]: B2.P$2(BAT-) C4.2 ETH1.P$1(GND_1) ETH1.P$2(GND_2) ETH1.P$12(GND_3) J70.P$1 J70.P$2 J72.P$1 J72.P$2 J74.P$1 J74.P$2 J76.P$1 J76.P$2 SV2.5 SV2.6 SV2.13 SV2.14 SV2.19 SV2.20 SV2.29 SV2.30 SV2.33 SV2.34 SV4.9 SV4.10 SV4.25 SV4.26 SV4.39 SV4.40 SV6.3 SV6.4 SV11.1 SV12.1 SV13.2 U7.4(GND) ; also sheet 1,2,3,4
GPIO0: J11.P$1 J11.P$2 ; also sheet 1
GPIO1: SV13.5 ; also sheet 1
GPIO4: J71.P$1 J71.P$2 ; also sheet 1
GPIO5: J73.P$1 J73.P$2 ; also sheet 1
GPIO6: J75.P$1 J75.P$2 ; also sheet 1
GPIO7: J77.P$1 J77.P$2 ; also sheet 1
GPIO8: SV11.5 ; also sheet 1
GPIO18: U7.6(SCK) ; also sheet 1
GPIO19: U7.1(!CS) ; also sheet 1
GPIO24: J9.P$1 J9.P$2 ; also sheet 1
GPIO56: SV13.8 ; also sheet 1
GPIO58: U7.5(SI) ; also sheet 1
GPIO59: U7.2(SO) ; also sheet 1
GPIO122: J66.P$1 J66.P$2 ; also sheet 1
GPIO123: J67.P$1 J67.P$2 ; also sheet 1
GPIO124: J68.P$1 J68.P$2 ; also sheet 1
GPIO125: J69.P$1 J69.P$2 ; also sheet 1
GPIO139: SV13.1 ; also sheet 1
N$17: R25.1 U7.7(!HOLD)
N$49 [supply]: SV4.1 SV4.2
N$54: SV5.1 SV5.2
N$58: SV5.3 SV5.4
N$61: SV5.5 SV5.6
N$71 [supply]: SV4.3 SV4.4
N$72 [supply]: SV4.5 SV4.6
N$73 [supply]: SV4.7 SV4.8
N$74: ETH1.P$6(INT/) SV5.7 SV5.8
N$75 [supply]: SV4.11 SV4.12
N$76 [supply]: SV4.13 SV4.14
N$77 [supply]: SV4.15 SV4.16
N$78 [supply]: SV4.17 SV4.18
N$79 [supply]: SV4.19 SV4.20
N$80 [supply]: SV4.21 SV4.22
N$120 [supply]: SV4.23 SV4.24
N$121: ETH1.P$7(MISO) SV5.9 SV5.10
N$122 [supply]: SV4.27 SV4.28
N$123 [supply]: SV4.29 SV4.30
N$124 [supply]: SV4.31 SV4.32
N$126 [supply]: SV4.33 SV4.34
N$128 [supply]: SV4.35 SV4.36
N$134 [supply]: SV4.37 SV4.38
N$135: ETH1.P$5(SS/) SV5.11 SV5.12
N$136 [supply]: SV2.39 SV2.40
N$137 [supply]: SV2.37 SV2.38
N$138 [supply]: SV2.35 SV2.36
N$140 [supply]: SV2.31 SV2.32
N$142 [supply]: SV2.27 SV2.28
N$143 [supply]: SV2.25 SV2.26
N$144 [supply]: SV2.23 SV2.24
N$145 [supply]: SV2.21 SV2.22
N$146: SV6.5 SV6.6
N$147 [supply]: SV2.17 SV2.18
N$148 [supply]: SV2.15 SV2.16
N$149: ETH1.P$8(RESET) SV6.7 SV6.8
N$150 [supply]: SV2.11 SV2.12
N$151 [supply]: SV2.9 SV2.10
N$152 [supply]: SV2.7 SV2.8
N$154: ETH1.P$3(MOSI) SV6.9 SV6.10
N$155: ETH1.P$4(SCLK) SV6.11 SV6.12
N$193 [supply]: J88.P$2(R+) J89.P$1 J89.P$2
N$194 [supply]: J88.P$5(R-) J90.P$1 J90.P$2
N$195 [supply]: J88.P$1 J91.P$1 J91.P$2
N$196 [supply]: J88.P$3 J92.P$1 J92.P$2
N$197 [supply]: J88.P$4 J93.P$1 J93.P$2
POWER [supply]: B2.P$1(BAT+) ; also sheet 1,3
VCC [supply]: C4.1 ETH1.P$10(3V3_1) ETH1.P$11(3V3_2) R25.2 SV6.1 SV6.2 SV11.2 SV12.2 SV13.3 SV13.7 U7.8(VCC) ; also sheet 1,2,3,4
Unconnected: ETH1.P$9(NC) SV12.3 SV12.5 SV13.4 SV13.6 U7.3(DNU)

### Notes on the sheet
- For Pushbuttons

## Library data of the parts
3V3 5V LED1-LED17 = led:LED: LED OSRAM: - CHIPLED LG R971, LG N971, LY N971, LG Q971, LY Q971, LO R971, LY R971 LH N974, LH R974 LS Q976, LO Q976, LY Q976 LO Q996 - Hyper CHIPLED LW Q18S LB Q993, LB Q99A, LB R99A - SideLED LS A670, LO A670, LY A670, LG A670, LP A670 LB A673, LV A673, LT A673, LW A673 LH A674 LY A675 LS A676, LA A676, LO A676, LY A676, LW A676 LS A679, LY A679, LG A679 - Hyper Micro SIDELED® LS Y876, LA Y876, LO Y876, LY Y876 LT Y87S - SmartLED LW L88C, LW L88S LB L89C, LB L89S, LG L890 LS L89K, LO L89K, LY L89K LS L896, LA L896, LO L896, LY L896 - TOPLED LS T670, LO T670, LY T670, LG T670, LP T670 LSG T670, LSP T670, LSY T670, LOP T670, LYG T670 LG T671, LOG T671, LSG T671 LB T673, LV T673, LT T673, LW T673 LH T674 LS T676, LA T676, LO T676, LY T676, LB T676, LH T676, LSB T676, LW T676 LB T67C, LV T67C, LT T67C, LS T67K, LO T67K, LY T67K, LW E67C LS E67B, LA E67B, LO E67B, LY E67B, LB E67C, LV E67C, LT E67C LW T67C LS T679, LY T679, LG T679 LS T770, LO T770, LY T770, LG T770, LP T770 LB T773, LV T773, LT T773, LW T773 LH T774 LS E675, LA E675, LY E675, LS T675 LS T776, LA T776, LO T776, LY T776, LB T776 LHGB T686 LT T68C, LB T68C - Hyper Mini TOPLED® LB M676 - Mini TOPLED Santana® LG M470 LS M47K, LO M47K, LY M47K Source: http://www.osram.convergy.de LUXEON: - LUMILED® LXK2-PW12-R00, LXK2-PW12-S00, LXK2-PW14-U00, LXK2-PW14-V00 LXK2-PM12-R00, LXK2-PM12-S00, LXK2-PM14-U00 LXK2-PE12-Q00, LXK2-PE12-R00, LXK2-PE12-S00, LXK2-PE14-T00, LXK2-PE14-U00 LXK2-PB12-K00, LXK2-PB12-L00, LXK2-PB12-M00, LXK2-PB14-N00, LXK2-PB14-P00, LXK2-PB14-Q00 LXK2-PR12-L00, LXK2-PR12-M00, LXK2-PR14-Q00, LXK2-PR14-R00 LXK2-PD12-Q00, LXK2-PD12-R00, LXK2-PD12-S00 LXK2-PH12-R00, LXK2-PH12-S00 LXK2-PL12-P00, LXK2-PL12-Q00, LXK2-PL12-R00 Source: www.luxeon.com KINGBRIGHT: KA-3528ASYC Source: www.kingbright.com
B1 = SE423EagleLibrary:BUZZER
B2 = SE423EagleLibrary:BATTERY_4AA_HOLDER
B3-B5 = custom:BANANA_MALE
C1 C12 C13 C15 C20 C25 C27 C28 = rcl:CPOL-US: POLARIZED CAPACITOR, American symbol
C2-C11 C14 C16-C19 C22-C24 = rcl:C-US: CAPACITOR, American symbol
DCDC3.3V DCDC5V = pinhead:PINHD-1X3: PIN HEADER
ETH1 = wiznet:USR_ES1_W5500
G1 = battery:CR2032V: LI BATTERY Varta
IC1-IC3 = 74xx-us:74*04: Hex INVERTER
J1-J4 J6 J10 J14-J21 J23 J24 J28-J33 J98-J170 J176 J177 = strip:STRIP3
J5 = POWER-IN:JACK-PMS
J7-J9 J11-J13 J22 J25-J27 J34-J38 J66-J87 J89-J93 J194 J196-J209 J251 = strip:STRIP2
J88 = SE423EagleLibrary:RELAY_JQC-3F_5V
JP2 JP3 = jumper:JP1E: JUMPER
L1 = SE423EagleLibrary:F28379D_LAUNCHPAD
P1 = custom:TH_PUSHBOTTON
POWER = pinhead:PINHD-1X2: PIN HEADER
Q1 = crystal:CRYTAL: CRYSTAL
R1-R38 R40-R44 = rcl:R-US_: RESISTOR, American symbol
S1 S159 = switch_slide:SWITCH_SLIDE
S17 S18 S129 S130 S137-S139 S141 S147 S167-S189 S210-S226 = custom:STRIP5
S20 S24 S53 S58 = custom:STRIP10
SV1 SV3 SV7 SV8 TRIMPOT1 TRIMPOT2 = con-lstb:MA03-2: PIN HEADER; OC_FARNELL: unknown; OC_NEWARK: unknown
SV2 SV4 = con-lstb:MA20-2: PIN HEADER; OC_FARNELL: unknown; OC_NEWARK: unknown
SV5 SV6 = con-lstb:MA06-2: PIN HEADER; OC_FARNELL: unknown; OC_NEWARK: unknown
SV9 SV10 = con-lstb:MA03-1: PIN HEADER; OC_FARNELL: unknown; OC_NEWARK: unknown
SV11 SV12 = con-lstb:MA05-1: PIN HEADER; OC_FARNELL: unknown; OC_NEWARK: unknown
SV13 = con-lstb:MA04-2: PIN HEADER; OC_FARNELL: unknown; OC_NEWARK: unknown
SV14 = con-lstb:MA07-2: PIN HEADER
SV15 = con-lstb:MA08-2: PIN HEADER; OC_FARNELL: unknown; OC_NEWARK: unknown
T1 T2 = keres:TIP125: PNP Transistor
U1 U5 = custom:A3953
U2 U4 = SE423EagleLibrary:DRV8874
U3 = custom6:BQ32000
U6 = custom5:MAX4506-SOIC8
U7 = custom6:IS62WVS512
U8 = custom6:TMS320F28027DAS
U$1 = MPU-9250_Breakoutboard:MPU-9250-BB
U$2 U$3 = SE423EagleLibrary:GEARMOTOR_MOUNT
U$4 = SE423EagleLibrary:CASTERWHEEL

## Net classes
0 default: width 0.203 mm, drill 0.508 mm, clearance 0.203 mm
1 supply: width 0.61 mm, drill 0.508 mm, clearance 0.203 mm